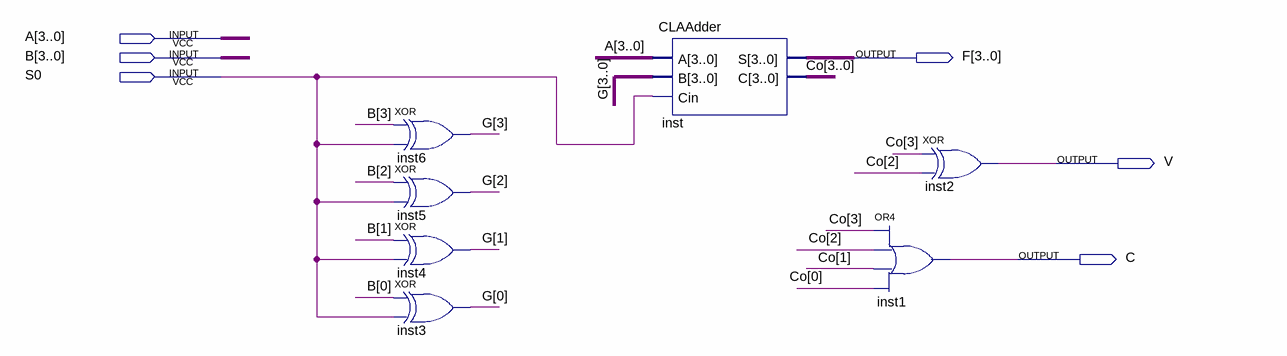
[diagram p0: schematic sheet]
// Quartus schematic ArithmeticUnit.bdf as structural Verilog: 7 symbols, 6 pins
module ArithmeticUnit (
  input  [3:0] A,
  input  [3:0] B,
  input  S0,
  output [3:0] F,
  output V,
  output C
);

  wire [3:0] Co, G;

  xor inst6 (G[3], B[3], S0);
  xor inst5 (G[2], B[2], S0);
  xor inst4 (G[1], B[1], S0);
  xor inst3 (G[0], B[0], S0);
  CLAAdder inst (.A(A), .B(G), .Cin(S0), .S(F), .C(Co));
  xor inst2 (V, Co[3], Co[2]);
  or inst1 (C, Co[3], Co[2], Co[1], Co[0]);
endmodule
